# EAGLE design sensor card (EAGLE 9.6.2)
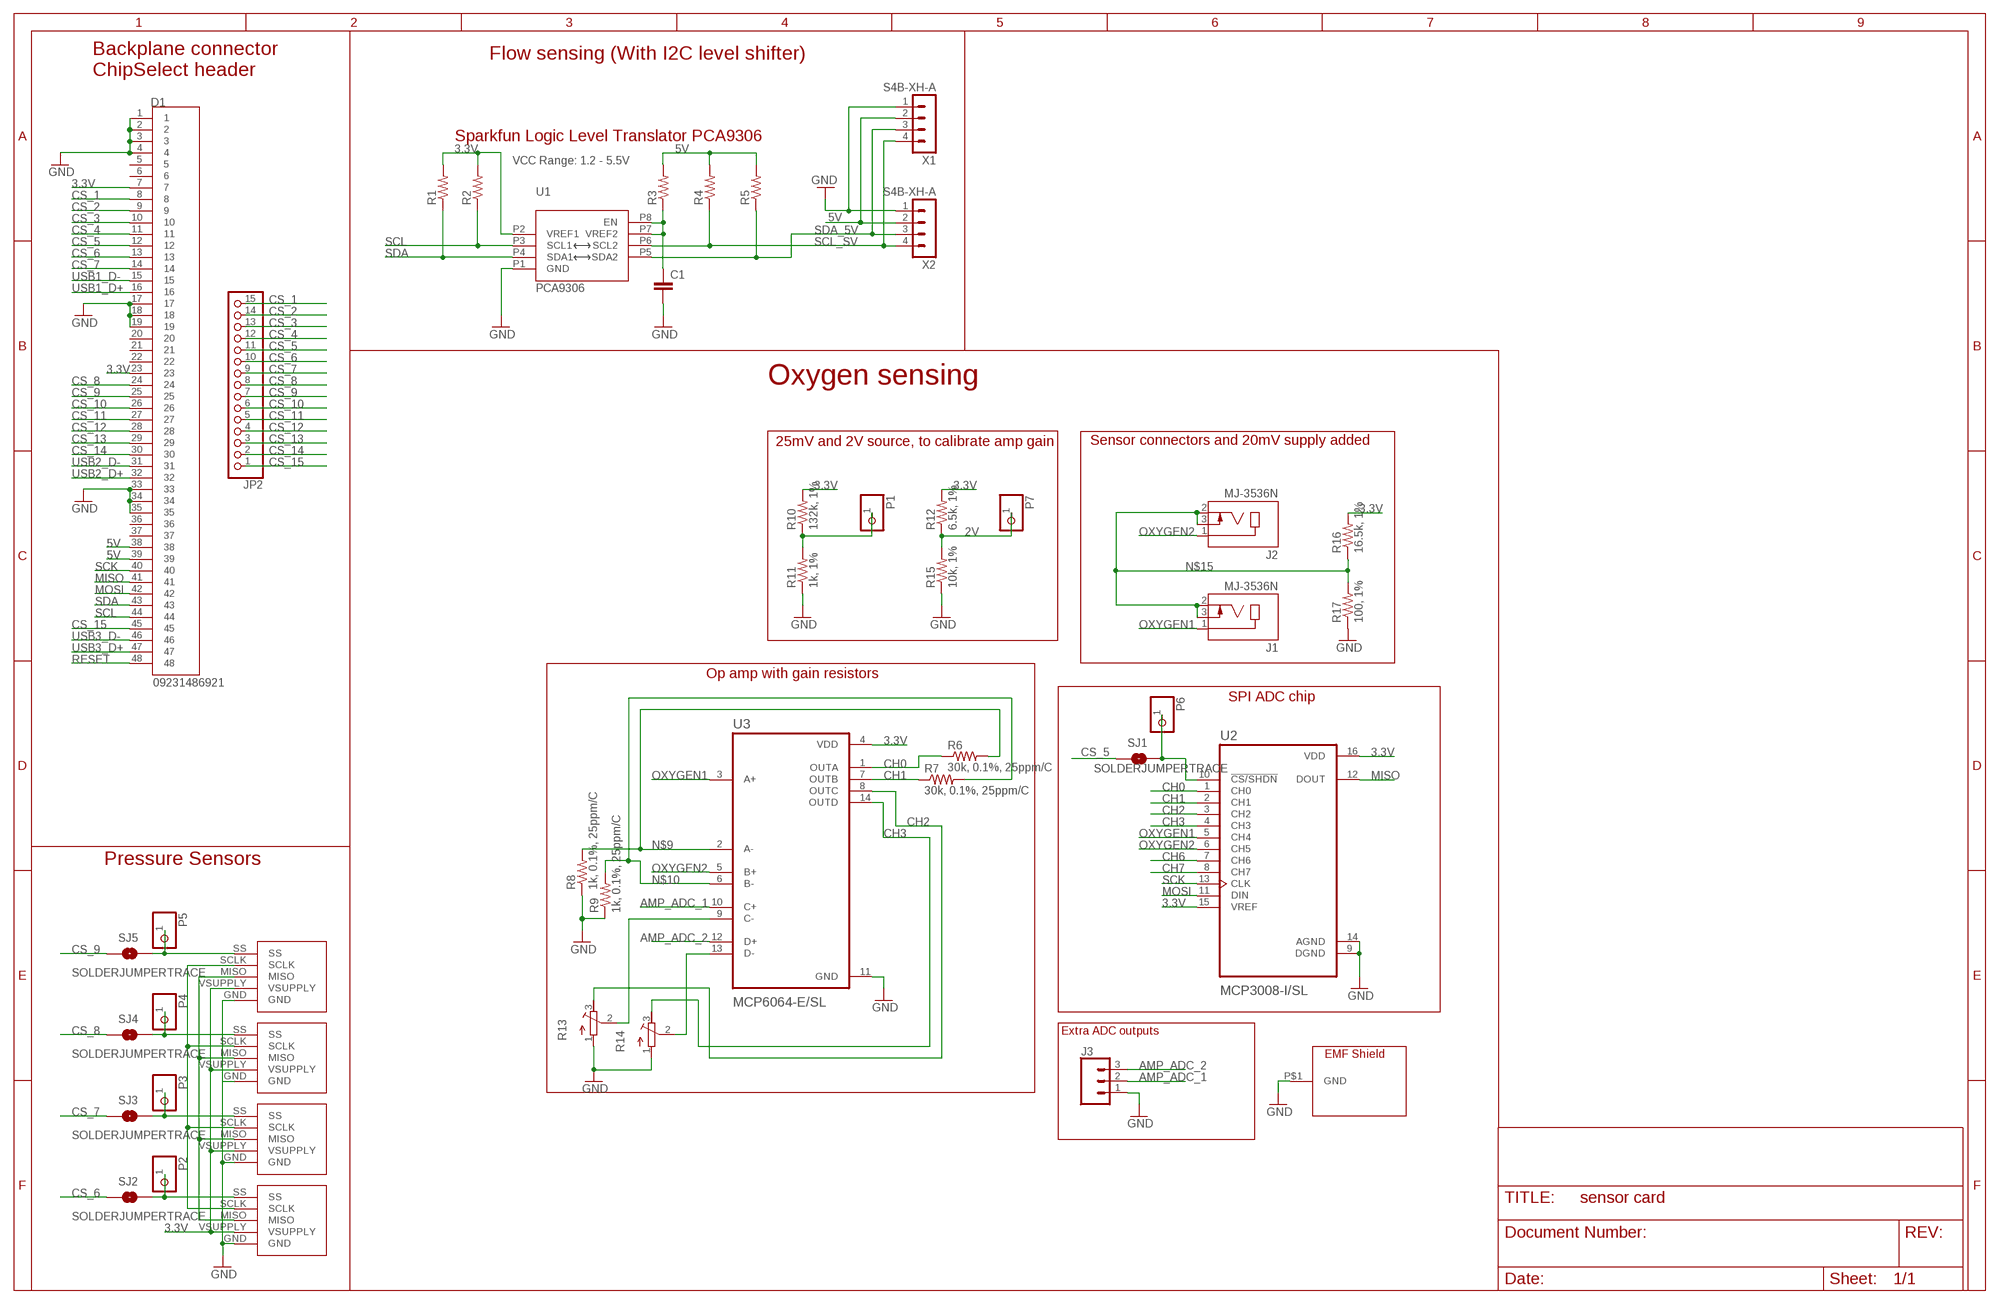
[diagram p0: schematic, sheet 1]

## Parts
C1  100pF  CAP0805  [0805]
D1  09231486921  [HARTING_09231486921]
J1  MJ-3536N  [CUI_MJ-3536N]
J2  MJ-3536N  [CUI_MJ-3536N]
J3  CONN_03  [1X03]
JP2  PINHD-1X15  [1X15]
P1  PINHD-1X1  [1X01]
P2  PINHD-1X1  [1X01]
P3  PINHD-1X1  [1X01]
P4  PINHD-1X1  [1X01]
P5  PINHD-1X1  [1X01]
P6  PINHD-1X1  [1X01]
P7  PINHD-1X1  [1X01]
R1  2.2k  RESISTOR0805-RES  [0805]
R2  2.2k  RESISTOR0805-RES  [0805]
R3  200K  RESISTOR0805-RES  [0805]
R4  2.2k  RESISTOR0805-RES  [0805]
R5  2.2k  RESISTOR0805-RES  [0805]
R6  30k, 0.1%, 25ppm/C  RESISTOR0805-RES  [0805]
R7  30k, 0.1%, 25ppm/C  RESISTOR0805-RES  [0805]
R8  1k, 0.1%, 25ppm/C  RESISTOR0805-RES  [0805]
R9  1k, 0.1%, 25ppm/C  RESISTOR0805-RES  [0805]
R10  132k, 1%  RESISTOR0805-RES  [0805]
R11  1k, 1%  RESISTOR0805-RES  [0805]
R12  6.5k, 1%  RESISTOR0805-RES  [0805]
R13  R-TRIMM3214W  [RTRIM3214W]
R14  R-TRIMM3214W  [RTRIM3214W]
R15  10k, 1%  RESISTOR0805-RES  [0805]
R16  16.5k, 1%  RESISTOR0805-RES  [0805]
R17  100, 1%  RESISTOR0805-RES  [0805]
SJ1  SOLDERJUMPERTRACE  [SJ_2S-TRACE]
SJ2  SOLDERJUMPERTRACE  [SJ_2S-TRACE]
SJ3  SOLDERJUMPERTRACE  [SJ_2S-TRACE]
SJ4  SOLDERJUMPERTRACE  [SJ_2S-TRACE]
SJ5  SOLDERJUMPERTRACE  [SJ_2S-TRACE]
U1  PCA9306  PCA9306VSSOP_8PIN  [VSSOP_8PIN]
U2  MCP3008-I/SL  [SOIC127P600X175-16N]
U3  MCP6064-E/SL  [SOIC127P600X175-14N]
U$1  SCCDRRV100MDSA3SSCDRRV100MDSA3  [DIP1270W53P254L1303H508Q8B]
U$2  EMI_SHIELD  [3671250]
U$3  SCCDRRV100MDSA3SSCDRRV100MDSA3  [DIP1270W53P254L1303H508Q8B]
U$4  SCCDRRV100MDSA3SSCDRRV100MDSA3  [DIP1270W53P254L1303H508Q8B]
U$5  SCCDRRV100MDSA3SSCDRRV100MDSA3  [DIP1270W53P254L1303H508Q8B]
X1  S4B-XH-A  [S4B-XH-A]
X2  S4B-XH-A  [S4B-XH-A]

## Nets
2V: P7.1 R12.1 R15.2
3.3V: D1.7 D1.23 R1.2 R2.2 R10.2 R12.2 R16.2 U1.P2(VREF1) U2.15(VREF) U2.16(VDD) U3.4(VDD) U$1.VSUPPLY U$3.VSUPPLY U$4.VSUPPLY U$5.VSUPPLY
5V: D1.38 D1.39 R3.2 R4.2 R5.2 X1.2 X2.2
50MILIVOLT: P1.1 R10.1 R11.2
AMP_ADC_1: J3.2 U3.10(C+)
AMP_ADC_2: J3.3 U3.12(D+)
CH0: R6.1 U2.1(CH0) U3.1(OUTA)
CH1: R7.1 U2.2(CH1) U3.7(OUTB)
CH2: R13.3(E) U2.3(CH2) U3.8(OUTC)
CH3: R14.3(E) U2.4(CH3) U3.14(OUTD)
CH6: U2.7(CH6)
CH7: U2.8(CH7)
CS_1: D1.8 JP2.15
CS_2: D1.9 JP2.14
CS_3: D1.10 JP2.13
CS_4: D1.11 JP2.12
CS_5: D1.12 JP2.11 SJ1.1
CS_6: D1.13 JP2.10 SJ2.1
CS_7: D1.14 JP2.9 SJ3.1
CS_8: D1.24 JP2.8 SJ4.1
CS_9: D1.25 JP2.7 SJ5.1
CS_10: D1.26 JP2.6
CS_11: D1.27 JP2.5
CS_12: D1.28 JP2.4
CS_13: D1.29 JP2.3
CS_14: D1.30 JP2.2
CS_15: D1.45 JP2.1
GND: C1.2 D1.1 D1.2 D1.3 D1.4 D1.17 D1.18 D1.19 D1.33 D1.34 D1.35 J3.1 R8.1 R9.1 R11.1 R13.1(A) R14.1(A) R15.1 R17.1 U1.P1(GND) U2.9(DGND) U2.14(AGND) U3.11(GND) U$1.GND U$2.P$1(GND) U$3.GND U$4.GND U$5.GND X1.1 X2.1
MISO: D1.41 U2.12(DOUT) U$1.MISO U$3.MISO U$4.MISO U$5.MISO
MOSI: D1.42 U2.11(DIN)
N$2: R14.2(S) U3.13(D-)
N$3: P6.1 SJ1.2 U2.10(!CS/SHDN)
N$6: P2.1 SJ2.2 U$5.SS
N$8: R13.2(S) U3.9(C-)
N$9: R6.2 R8.2 U3.2(A-)
N$10: R7.2 R9.2 U3.6(B-)
N$11: P4.1 SJ4.2 U$3.SS
N$12: P5.1 SJ5.2 U$1.SS
N$15: J1.2 J1.3 J2.2 J2.3 R16.1 R17.2
N$35: P3.1 SJ3.2 U$4.SS
OXYGEN1: J1.1 U2.5(CH4) U3.3(A+)
OXYGEN2: J2.1 U2.6(CH5) U3.5(B+)
RESET: D1.48
SCK: D1.40 U2.13(CLK) U$1.SCLK U$3.SCLK U$4.SCLK U$5.SCLK
SCL: D1.44 R2.1 U1.P3(SCL1)
SCL_SV: R4.1 U1.P6(SCL2) X1.4 X2.4
SDA: D1.43 R1.1 U1.P4(SDA1)
SDA_5V: R5.1 U1.P5(SDA2) X1.3 X2.3
USB1_D+: D1.16
USB1_D-: D1.15
USB2_D+: D1.32
USB2_D-: D1.31
USB3_D+: D1.47
USB3_D-: D1.46
VREF2_IN: C1.1 R3.1 U1.P7(VREF2) U1.P8(EN)
Unconnected: D1.5 D1.6 D1.20 D1.21 D1.22 D1.36 D1.37

## Notes on the sheet
- Flow sensing (With I2C level shifter)
- Backplane connector 
  ChipSelect header
- Sparkfun Logic Level Translator PCA9306
- VCC Range: 1.2 - 5.5V
- Oxygen sensing
- 25mV and 2V source, to calibrate amp gain | Sensor connectors and 20mV supply added
- Op amp with gain resistors
- SPI ADC chip
- Pressure Sensors
- Extra ADC outputs

## Library data of the parts
C1 = SparkFun-Passives:CAP: Capacitor Standard 0603 ceramic capacitor, and 0.1" leaded capacitor.; MANUFACTURER-PART-NUMBER: Generic; PACKAGE: 0805; SIMILAR-COMPONENTS: Other generic 0805 capacitors
D1 = din41612_48_pin_board:09231486921: Check prices <https://pricing.snapeda.com/parts/8-1393644-0/TE%20Connectivity/view-part?ref=eda>; MANUFACTURER-PART-NUMBER: 09231486921; PACKAGE: None
J1 J2 = MJ-3536N:MJ-3536N: 2 Conductors 3 Contacts 12V 3.5 mm Right Angle Through Hole Audio Jack Connector; MANUFACTURER-PART-NUMBER: MJ-3536N; PACKAGE: None
J3 = SparkFun-Connectors:CONN_03: Multi connection point. Often used as Generic Header-pin footprint for 0.1 inch spaced/style header connections On any of the 0.1 inch spaced packages, you can populate with these: Break Away Headers - Straight <https://www.sparkfun.com/products/116> (PRT-00116) Break Away Male Headers - Right Angle <https://www.sparkfun.com/products/553> (PRT-00553) Female Headers <https://www.sparkfun.com/products/115> (PRT-00115) Break Away Headers - Machine Pin <https://www.sparkfun.com/products/117> (PRT-00117) Break Away Female Headers - Swiss Machine Pin <https://www.sparkfun.com/products/743> (PRT-00743) Stackable Header - 3 Pin (Female, 0.1") <https://www.sparkfun.com/products/13875> (PRT-13875) For SCREWTERMINALS and SPRING TERMINALS visit here: Screw Terimnals on SparkFun.com <https://www.sparkfun.com/search/results?term=Screw+Terminals> (5mm/3.5mm/2.54mm spacing) This device is also useful as a general connection point to wire up your design to another part of your project. Our various solder wires solder well into these plated through hole pads. Hook-Up Wire - Assortment (Stranded, 22 AWG) <https://www.sparkfun.com/products/11375> (PRT-11375) Hook-Up Wire - Assortment (Solid Core, 22 AWG) <https://www.sparkfun.com/products/11367> (PRT-11367) View the entire wire category on our website here <https://www.sparkfun.com/categories/141> Special notes: Molex polarized connector foot print use with SKU : PRT-08232 with associated crimp pins and housings.
JP2 = pinhead:PINHD-1X15: PIN HEADER
P1-P7 = pinhead:PINHD-1X1: PIN HEADER
R1-R12 R15-R17 = SparkFun-Passives:RESISTOR: Resistor Basic schematic elements and footprints for 0603, 1206, and PTH resistors.; MANUFACTURER-PART-NUMBER: Generic; PACKAGE: 0805; SIMILAR-COMPONENTS: Generic 0805 resistors
R13 R14 = rcl:R-TRIMM: Trimm resistor; PURCHASE: https://www.digikey.ca/en/products/detail/bourns-inc/3214W-1-502G/2535183; SPICEMODEL: X; SPICEPREFIXL: POT
SJ1-SJ5 = SparkFun-Passives:SOLDERJUMPER: Solder Jumper Standard SMD solder jumper. Used to automate production. Two varients : Normally Open and Normally Closed are the same, but have different paste layers. NC will have a large amount of paste and should jumper during reflow.
U1 = SparkFun-IC-Comms:PCA9306: Bidirectional I2C level shifter Not compatible with all available part number pinout schemes- DOUBLE CHECK!!! Variants PCA9306DC and PSOP-8 are EOL. If your part has VREF as pin 1 then this is your variant. VSSOP_8PIN is not EOL. Datasheet <https://cdn.sparkfun.com/datasheets/BreakoutBoards/PCA9306DC.pdf> SparkFun Products SparkFun Inventor's Kit for RedBot <https://www.sparkfun.com/products/12649> (ROB-12649) SparkFun RedBot Basic Kit <https://www.sparkfun.com/products/13166> (ROB-13166) SparkFun Level Translator Breakout - PCA9306 <https://www.sparkfun.com/products/11955> (BOB-11955) SparkFun Block for Intel Edison - ADC <https://www.sparkfun.com/products/13770> (DEV-13770) SparkFun Block for Intel® Edison - Raspberry Pi B <https://www.sparkfun.com/products/13044> (DEV-13044) SparkFun RedBot Sensor - Accelerometer <https://www.sparkfun.com/products/12589> (SEN-12589); MANUFACTURER-PART-NUMBER: PCA9306D,118; PROD_ID: IC-14450
U2 = MCP3008-I_SL:MCP3008-I/SL: Check prices <https://pricing.snapeda.com/parts/MCP3008-I/SL/Microchip%20Technology/view-part?ref=eda>; MANUFACTURER-PART-NUMBER: MCP3008-I/SL; PACKAGE: SOIC-16
U3 = MCP6064-E_SL:MCP6064-E/SL: None Check prices <https://pricing.snapeda.com/parts/MCP6064-E/SL/Microchip/view-part?ref=eda>; MANUFACTURER-PART-NUMBER: MCP6064-E/SL; PACKAGE: SOIC-14 Microchip
U$1 U$3-U$5 = SCCDRRV100MDSA3:SCCDRRV100MDSA3
U$2 = emi cap:EMI_SHIELD; MANUFACTURER-PART-NUMBER: 3671250; PACKAGE: none
X1 X2 = con-JST XH:S4B-XH: JST XH series header 2.50mm pitch disconnectable crimp style connectors, horizontal (side entry type), 4 pins

## Net classes
1 POWER: clearance 0.508 mm

## Board
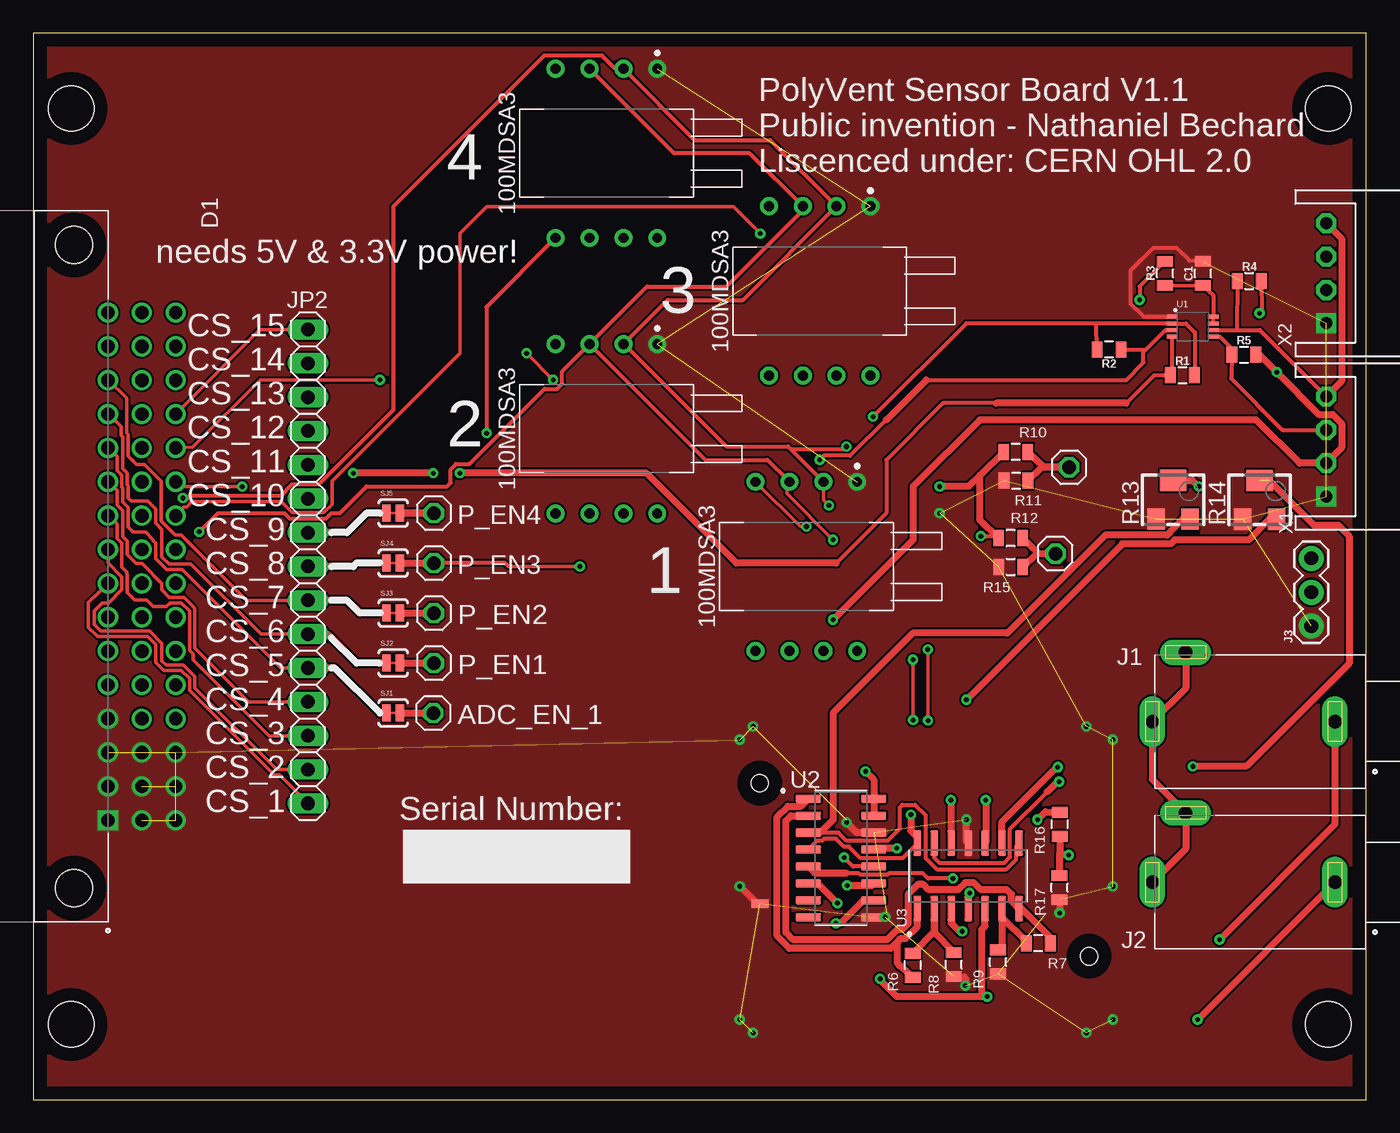
[diagram p1: board, top side]
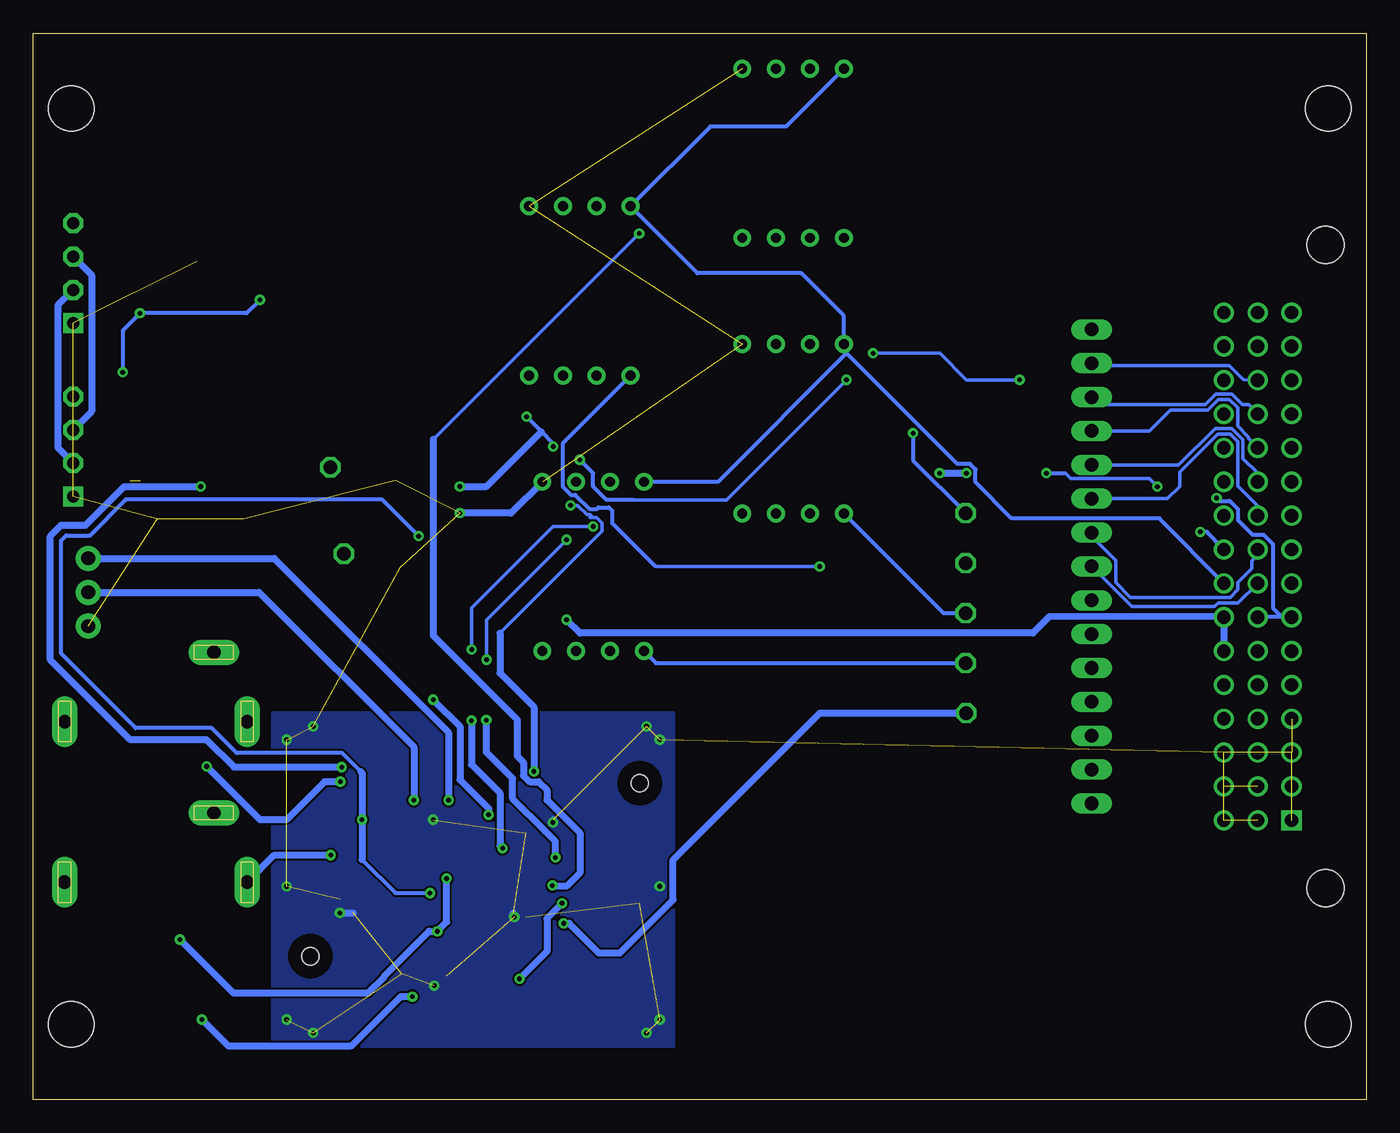
[diagram p2: board, bottom side, seen from below]

Size 100 x 80 mm. Coordinates in mm from the lower left corner, seen from the top.
Outline: 0,0 100,0 100,80 0,80 0,0
Copper layers (1*16): Top 0.035mm / dielectric 1.5mm / Bottom 0.035mm
Design rules "default": minimum track width 6mil, minimum drill 0.35mm, track to track 6mil, track to pad 6mil, pad to pad 6mil, via to via 6mil, smd to smd 6mil, copper to edge 40mil, drill to drill 6mil, minimum pad ring 10mil, minimum via ring 8mil, stop-mask expansion 4mil, vias tented up to drill 0mil, thermal gap 10mil
Holes 3.4 mm at 2.84,5.64 2.84,74.36 97.16,74.36 97.16,5.64

### Footprints (pad centres in the part's own frame; a part is rotated, then mirrored left to right if it is on the bottom)
0805 = smd 0.8 x 1.2: 1 -0.9,0; 2 0.9,0
HARTING_09231486921 = drill 1 pad 1.35 square: 1 0,0 | drill 1 pad 1.35: 2 -2.54,0; 3 -5.08,0; 4 -7.62,0; 5 -10.16,0; 6 -12.7,0; 7 -15.24,0; 8 -17.78,0; 9 -20.32,0; 10 -22.86,0; 11 -25.4,0; 12 -27.94,0; 13 -30.48,0; 14 -33.02,0; 15 -35.56,0; 16 -38.1,0; 17 0,2.54; 18 -2.54,2.54; 19 -5.08,2.54; 20 -7.62,2.54; 21 -10.16,2.54; 22 -12.7,2.54; 23 -15.24,2.54; 24 -17.78,2.54; 25 -20.32,2.54; 26 -22.86,2.54; 27 -25.4,2.54; 28 -27.94,2.54; 29 -30.48,2.54; 30 -33.02,2.54; 31 -35.56,2.54; 32 -38.1,2.54; 33 0,5.08; 34 -2.54,5.08; 35 -5.08,5.08; 36 -7.62,5.08; 37 -10.16,5.08; 38 -12.7,5.08; 39 -15.24,5.08; 40 -17.78,5.08; 41 -20.32,5.08; 42 -22.86,5.08; 43 -25.4,5.08; 44 -27.94,5.08; 45 -30.48,5.08; 46 -33.02,5.08; 47 -35.56,5.08; 48 -38.1,5.08 | hole 2.8: -43.18,-2.54; 5.08,-2.54
CUI_MJ-3536N = drill 1 pad 1.9 long: 1 -5.6,0; 2 8.1,0; 3 5.6,-5.2
1X03 = drill 1.016 pad 1.88: 1 0,0; 2 2.54,0; 3 5.08,0
1X15 = drill 1.016 long: 1 -17.78,0; 2 -15.24,0; 3 -12.7,0; 4 -10.16,0; 5 -7.62,0; 6 -5.08,0; 7 -2.54,0; 8 0,0; 9 2.54,0; 10 5.08,0; 11 7.62,0; 12 10.16,0; 13 12.7,0; 14 15.24,0; 15 17.78,0
1X01 = drill 1.016 octagon: 1 0,0
RTRIM3214W = smd 1.3 x 1.6: 1 -1.275,-1.45; 3 1.275,-1.45 | smd 2 x 1.6: 2 0,1.45
SJ_2S-TRACE = smd 0.635 x 1.27: 1 -0.508,0; 2 0.508,0
VSSOP_8PIN = smd 0.8 x 0.3: P1 -1.57,0.734; P2 -1.57,0.234; P3 -1.57,-0.266; P4 -1.57,-0.766; P5 1.53,-0.766; P6 1.53,-0.266; P7 1.53,0.234; P8 1.53,0.734
SOIC127P600X175-16N = smd 1.9 x 0.6: 1 -2.455,4.445; 2 -2.455,3.175; 3 -2.455,1.905; 4 -2.455,0.635; 5 -2.455,-0.635; 6 -2.455,-1.905; 7 -2.455,-3.175; 8 -2.455,-4.445; 9 2.455,-4.445; 10 2.455,-3.175; 11 2.455,-1.905; 12 2.455,-0.635; 13 2.455,0.635; 14 2.455,1.905; 15 2.455,3.175; 16 2.455,4.445
SOIC127P600X175-14N = smd 1.9 x 0.6: 1 -2.455,3.81; 2 -2.455,2.54; 3 -2.455,1.27; 4 -2.455,0; 5 -2.455,-1.27; 6 -2.455,-2.54; 7 -2.455,-3.81; 8 2.455,-3.81; 9 2.455,-2.54; 10 2.455,-1.27; 11 2.455,0; 12 2.455,1.27; 13 2.455,2.54; 14 2.455,3.81
DIP1270W53P254L1303H508Q8B = drill 0.743 pad 1.343: 6 6.35,-1.27; 7 6.35,1.27; 8 6.35,3.81; GND -6.35,3.81; MISO -6.35,-1.27; SCLK -6.35,-3.81; SS 6.35,-3.81; VSUPPLY -6.35,1.27
3671250 = smd 1.27 x 0.635: P$1 0,8.61 | hole 1.3: 0,17.65; 24.7,4.65
S4B-XH-A = drill 0.9 pad 1.5 square: 1 3.75,0 | drill 0.9 pad 1.5 octagon: 2 1.25,0; 3 -1.25,0; 4 -3.75,0

### Placement (x,y rotation side)
C1  87.75,61.98 90 top
D1  5.6,20.95 270 top
J1  92.05,28.36 180 top
J2  92.06,16.31 180 top
J3  95.88,35.52 90 top
JP2  20.6,40 270 top
P1  77.72,47.44 180 top
P2  30.05,32.75 0 top
P3  30.05,36.5 0 top
P4  30.05,40.25 0 top
P5  30.05,44 0 top
P6  30,29 0 top
P7  76.69,40.96 180 top
R1  86.21,54.34 0 top
R2  80.7,56.27 180 top
R3  84.91,61.99 90 top
R4  91.23,61.42 0 top
R5  90.82,55.88 0 top
R6  65.99,10.07 90 top
R7  75.4,11.72 180 top
R8  69.05,10.13 90 top
R9  72.37,10.33 90 top
R10  73.71,48.59 180 top
R11  73.72,46.44 0 top
R12  73.32,42.12 180 top
R13  85.51,45.01 0 top
R14  92,45 0 top
R15  73.33,39.96 0 top
R16  77.01,20.65 90 top
R17  76.99,15.91 90 top
SJ1  27,29 0 top
SJ2  27,32.75 0 top
SJ3  27,36.5 0 top
SJ4  27,40.25 0 top
SJ5  27,44 0 top
U1  87,58 0 top
U2  60.6,18.12 0 top
U3  70.14,16.78 90 top
U$1  43,71 270 top
U$2  54.51,6.1 0 top
U$3  59,60.67 270 top
U$4  43,50.33 270 top
U$5  58,40 270 top
X1  97,49 270 top
X2  97,62 270 top

### Tracks (layer width: path | path; a pad name or v marks a point on that pad's centre or on a via)
2V
  Top 0.508: R15.2 75.28,40.96 | R12.1 75.28,41.11 75.28,40.96 | 75.28,40.96 P7.1
3.3V  (via drill 0.35)
  Top 0.254: v59.69,44.58 59.27,45 U$5.VSUPPLY
  Top 0.305: 56.81,48.81 56.62,49 52,49 44.32,56.68 U$4.VSUPPLY 47.59,60 53.25,60 U$3.VSUPPLY 55.29,72 49.62,72 U$1.VSUPPLY 43.65,77.35 42.67,78.33 38.33,78.33 27,67 27,51.75 21.4,46.15 19.4,46.15 18.55,45.3 11.71,45.3 11.42,45 11.36,45 v11.23,45.13 | 56.81,48.81 U$5.VSUPPLY | 79.75,58.23 70,58.23 v63,51.23 | R1.2 87.15,54.35 87.15,57.56 86.48,58.23 U1.P2 79.75,58.23 | R2.2 79.75,58.23 | 56.81,48.81 60.81,48.81 v61,49 | v70.24,15.49 70.24,14.43 U3.4 | v71.09,42.27 72.22,42.27 R12.2
  Top 0.508: v62.44,24.62 63.05,24 U2.16 U2.15 | R10.2 71,46.83 | R12.2 71,43.49 71,46.83 | 71,46.83 70.17,46 v68,46 | v75.34,21 75.94,21.6 R16.2
  Bottom 0.254: 58,43.66 57.73,43.66 57.34,43.27 57.34,42.66 65,35 | 58,43.66 58.23,43.66 | 58,43.66 58.23,43.88 58.46,43.88 59.16,44.58 v59.69,44.58
  Bottom 0.305: v11.23,45.13 11.02,44.92 10.24,44.92 9.62,44.3 9.62,43.47 8.53,42.38 7.7,42.38 7,41.68 7,36.88 6.36,36.24 D1.7 D1.23 | v61,49 61,49.23 61.88,50.12 v63,51.23 | 75.34,18 72.83,15.49 v70.24,15.49 | 75.42,24.6 76.82,26 84.73,26 86.61,27.88 92.33,27.88 97.92,33.47 97.92,41.93 97.52,42.33 95.75,42.33 93.04,45.04 73.86,45.04 v71.09,42.27
  Bottom 0.508: 65,35 65,32 62.44,29.44 v62.44,24.62 | v68,46 66,46 61.88,50.12 | 75.42,24.6 75.34,24.52 v75.34,21 75.34,18
5V  (via drill 0.35)
  Top 0.305: R3.2 83,61.03 v83,60 | 98,48.75 X1.2 | v93.29,54.57 v93.29,54.56 | R4.2 92.18,59.18 v92,59
  Top 0.508: R5.2 91.98,55.88 v93.29,54.57 96.45,51.41 97.48,51.41 98.16,50.73 98.16,48.91 X1.2 95,47.75 91.75,51 71,51 66,46 66,42 v60,36
  Bottom 0.305: v83,60 84,59 v92,59 93.29,57.71 v93.29,54.57
  Bottom 0.508: v60,36 59,35 25,35 23.76,36.24 D1.39 D1.38 | X2.2 98.16,59.59 98.16,48.91 X1.2
50MILIVOLT
  Top 0.508: R11.2 75.67,47.44 P1.1 75.81,47.44 R10.1
AMP_ADC_1  (via drill 0.35)
  Top 0.508: v71.45,22.46 71.45,19.27 U3.10
  Bottom 0.508: J3.2 83.06,38.06 71.45,26.45 v71.45,22.46
AMP_ADC_2  (via drill 0.35)
  Top 0.508: v68.85,22.46 68.85,19.25 U3.12
  Bottom 0.508: J3.3 81.92,40.6 68.85,27.53 v68.85,22.46
CH0
  Top 0.508: 64.83,11.84 64.83,10.2 65.07,9.96 65.15,9.96 R6.1 | 64.83,11.84 65.07,12.08 65.44,12.08 66.33,12.97 U3.1 | 64.83,11.84 64.33,11.34 56.73,11.34 55.8,12.27 55.8,21.19 56.61,22 57.58,22 U2.1
CH1
  Top 0.508: R7.1 76.35,12.13 74.16,14.32 U3.7 73.39,14.89 73.39,15.4 73.04,15.75 71.09,15.75 70.56,16.27 69.92,16.27 69.39,15.75 67.17,15.75 66.78,16.13 66.36,16.13 65.62,15.4 65.62,13.2 65.16,12.74 64.8,12.74 64.06,12 57,12 56.46,12.54 56.46,20.92 56.84,21.3 U2.2
CH2
  Top 0.305: U2.3 60.42,20.02 61.02,19.42 64.09,19.42 65,20.33 65,21.91 65.2,22.11 66.16,22.11 66.95,21.32 66.95,18.11 67.78,17.28 73.01,17.28 73.74,18.01 73.74,19.03 U3.8
  Top 0.508: U2.3 58.99,20.02 59.09,20.13 59.13,20.13 60,21 60,29 66,35 73.07,35 80.42,42.35 85.05,42.35 85.29,42.59 85.29,42.61 86.24,43.56 R13.3
CH3  (via drill 0.35)
  Top 0.305: U3.14 65.2,18.11 62.06,18.11 61.21,18.96 60.83,18.96 60.23,19.57 59.33,19.57 59.18,19.42 58.81,19.42 U2.4
  Top 0.508: R14.3 92.75,43.55 91.2,42 85.63,42 85.33,41.69 81.69,41.69 v70,30 | v65.84,21.37 65.84,20.16 66.33,19.67 U3.14
  Bottom 0.508: v65.84,21.37 65.84,21.84 68,24 68,28 v70,30
CS_1
  Top 0.254: D1.8 4.13,37.31 4.13,35.43 4.83,34.73 8.57,34.73 9.17,34.13 9.17,32.81 9.79,32.19 11.11,32.19 11.71,31.59 11.71,30.71 18.07,24.35 18.47,24.35 JP2.15
CS_2
  Top 0.254: JP2.14 18.24,24.76 12.12,30.88 12.12,31.76 11.26,32.62 9.95,32.62 9.65,32.92 9.65,34.23 8.74,35.14 5.06,35.14 4.57,35.63 4.57,36.67 5.17,37.27 5.64,37.27 6.63,38.26 6.63,39.21 5.6,40.24 D1.9
CS_3
  Top 0.254: JP2.13 17.7,27.3 12,33 12,33.42 11.71,33.71 11.71,36.67 11.11,37.27 10.25,37.27 9.98,37 9,37 8.5,37.5 7.59,37.5 7.04,38.05 7.04,39.38 7,39.42 7,39.59 6.63,39.96 6.63,41.75 6.29,42.09 6.29,43.17 D1.10
CS_4
  Top 0.254: JP2.12 16.16,29.84 12.12,33.88 12.12,36.84 12,36.96 12,37 11.31,37.69 10.21,37.69 9.65,38.25 9.65,38.73 8.16,40.22 7.7,40.22 7.04,40.88 7.04,41.92 6.7,42.26 6.7,44.19 6.29,44.59 6.29,45.71 D1.11
CS_5
  Top 0.254: JP2.11 18.54,32.38 11.16,39.76 9.99,39.76 9.17,40.58 9.17,41.75 9,41.92 9,42 8.41,42.59 7.49,42.59 7.11,42.97 7.11,44.41 6.7,44.82 6.7,45.88 6.63,45.94 6.63,46.83 6.59,46.87 6.59,46.88 6.29,47.17 6.29,48.25 D1.12
  Top 0.508: JP2.11 22.62,32.38 26,29 SJ1.1
CS_6
  Top 0.254: JP2.10 17.08,34.92 11.82,40.18 10.19,40.18 9.65,40.72 9.65,42.78 9.17,43.25 9.17,44.29 8.57,44.89 7.34,44.89 7.11,45.13 7.11,46.04 7.04,46.11 7.04,47 7,47.04 6.7,47.34 6.7,49.73 6.59,49.83 6.59,50.49 D1.13
  Top 0.508: SJ2.1 24.25,32.75 22.08,34.92 JP2.10
CS_7
  Top 0.254: JP2.9 16,37.46 11.11,42.35 10.65,42.35 9.58,43.42 9.58,46.42 8.37,47.64 7.75,47.64 7.11,48.28 7.11,49.89 7,50 7,52.62 D1.14
  Top 0.508: SJ3.1 24.5,36.5 23.54,37.46 JP2.9
CS_8
  Top 0.508: SJ4.1 24.25,40.25 24,40 JP2.8
  Bottom 0.254: JP2.8 17.6,37 11.38,37 11.11,37.27 9.65,37.27 D1.24
CS_9
  Top 0.508: SJ5.1 25,44 23.54,42.54 JP2.7
  Bottom 0.254: D1.25 8.14,40.86 8.59,40.41 8.59,39.83 9.65,38.78 9.65,38.25 10.21,37.69 17.69,37.69 18.8,38.8 18.8,40.43 20.6,42.23 JP2.7
CS_10
  Bottom 0.254: D1.26 8.14,44.52 9.65,46.02 9.65,49.37 10.2,49.92 10.92,49.92 10.94,49.94 11.14,49.94 14,47.08 14,46 14.92,45.08 JP2.6
CS_11
  Bottom 0.254: D1.27 8.14,47 9.24,48.1 9.24,49.54 10.06,50.36 11.32,50.36 14.09,47.59 20.57,47.59 JP2.5
CS_12
  Bottom 0.254: D1.28 8.83,49.63 8.83,49.7 9.65,50.52 9.65,51.91 10.25,52.51 11.11,52.51 11.9,51.72 14.7,51.72 16.26,50.16 JP2.4
CS_13
  Bottom 0.254: D1.29 8.79,52.13 9.29,52.13 10.08,52.92 11.28,52.92 12.07,52.13 20.03,52.13 JP2.3
CS_14
  Bottom 0.254: D1.30 9.22,54.02 10.25,55.05 20.41,55.05 JP2.2
CS_15
  Top 0.254: D1.45 16.98,57.78 JP2.1
GND  (via drill 0.35)  (37 unrouted)
  Top 0.305: 87.52,63.06 C1.2 86.75,62.93 85.79,63.9 84.03,63.9 82.32,62.18 82.32,59.72 82.72,59.32 82.75,59.32 83.34,58.73 U1.P1
  Top 0.508: U2.9 63.88,13.68 v63.91,13.7 | U2.14 61.78,20.02 v61.02,20.79 | U3.11 70,19.38 v70,21 | R8.1 69.87,9.18 69.92,9.13 v69.92,8.54 | R17.1 77,14.95 v77,14 | U$2.P$1 54.4,14.6 v53,16
  Bottom 0.508: v63.91,13.7 64,13.79 64,14 | v61.02,20.79 61,20.81 61,21 | v77,14 76,14 | U$5.GND 64.16,44 v68,44
  other vias: 54,28 53,27 53,6 54,5 81,6 79,5 81,16 81,27 79,28
  pour Top (no thermals): 0,80 0,0 100,0 100,80
  pour Bottom: 52,29 52,4 82,4 82,29
MISO  (via drill 0.35)
  Top 0.254: v60,42 56.54,45.46 56.54,46.54 | v66,33 v66.01,32.99 v66.01,28.47
  Top 0.305: v12.44,42.59 13.85,44 18.84,44 19.23,43.61 21.97,43.61 22.36,44 23,44 25,46 31.05,46 31.32,46.27 31.32,47.28 31.72,47.68 32.73,47.68 38.36,53.32 39.28,53.32 39.68,53.72 39.68,54.64 U$4.MISO | U$4.MISO 46.05,61 52,61 57.73,66.73 U$3.MISO 53.75,71 48.08,71 U$1.MISO | U$4.MISO 50.41,48 55.08,48 56.54,46.54 U$5.MISO | U2.12 61.51,17.48 v60.83,18.16
  Bottom 0.254: v60,42 66,36 v66,33
  Bottom 0.305: D1.41 11.95,42.59 v12.44,42.59
  Bottom 0.508: v60.83,18.16 60.83,19.36 61.57,20.1 64.04,22.57 64.04,24.08 66.01,26.05 v66.01,28.47
MOSI  (via drill 0.35)
  Top 0.254: D1.42 11.29,44.47 11.5,44.47 11.89,44.87 18.58,44.87 19.41,44.04 21.79,44.04 22.4,44.65 22.4,46.4 32,56 32,65 34,67 52.52,67 v54.54,64.98
  Top 0.508: v61.05,16.05 62.9,16.05 U2.11
  Bottom 0.254: v54.54,64.98 70,49.52
  Bottom 0.508: 70,49.52 70,34.81 63.7,28.51 63.7,25.78 63.23,25.31 63.23,24.3 62.77,23.84 62.08,23.84 61.47,23.22 61.47,22.47 59,20 59,17 60,16 61,16 v61.05,16.05
N$2  (via drill 0.35)  (1 unrouted)
  Top 0.305: U3.13 67.6,18.15 67.99,17.76 72.84,17.76 73.28,18.2 73.28,20.3 76.08,23.09
  Top 0.508: 92.72,46.45 96.08,43.09 97.91,43.09 98.73,42.27 98.73,32.73 91,25 v87,25 | 76.08,23.09 76.84,23.85 v76.96,23.85
  Bottom 0.508: v76.96,23.85 78.15,23.85 81,21 83,21 v87,25
N$3  (via drill 0.35)
  Top 0.508: SJ1.2 P6.1 | U2.10 63.04,14.93 62.27,14.93 60.56,13.22 v60.21,13.22
  Bottom 0.508: v60.21,13.22 59.8,13.22 57.58,11 56,11 52,15 52,18 41,29 P6.1
N$6
  Top 0.508: SJ2.2 P2.1
  Bottom 0.305: U$5.SS 53.29,32.75 P2.1
N$8  (via drill 0.35)
  Top 0.508: U3.9 72.68,20.84 76.82,24.98 v76.86,24.94 | R13.2 86.97,46.46 v87.44,45.99
  Bottom 0.508: v87.44,45.99 93.19,45.99 96.08,43.09 97.91,43.09 98.73,42.27 98.73,33 92.73,27 87,27 84.94,24.94 v76.86,24.94
N$9
  Top 0.508: R8.2 67.6,12.53 U3.2 67.6,12.63 R6.2
N$10
  Top 0.508: R7.2 74.45,11.91 72.68,13.68 U3.6 72.68,11.59 R9.2
N$11  (via drill 0.35)
  Top 0.254: 35.66,40 v41,40
  Top 0.305: 35.66,40 35.39,40.27 30.07,40.27 P4.1
  Top 0.508: SJ4.2 P4.1
  Bottom 0.254: v41,40 53.3,40
  Bottom 0.305: 53.3,40 56.57,43.27 56.57,44.18 56.82,44.43 57.6,44.43 57.72,44.32 58.28,44.32 59.34,45.37 59.67,45.37 60.15,45.85 60.25,45.95 60.25,49.26 U$3.SS
N$12  (via drill 0.35)
  Top 0.305: U$1.SS 34,59.46 v34,50
  Top 0.508: 27.89,44 P5.1 SJ5.2
  Bottom 0.305: v34,50 34,47.95 P5.1
N$15  (via drill 0.35)
  Top 0.508: R16.1 77.01,18.48 76.99,18.48 | 76.99,18.48 R17.2 | J1.3 86.45,30.86 J1.2 83.95,24.02 J2.3 86.46,18.81 J2.2 | v77.68,18.34 77.13,18.34 76.99,18.48
  Bottom 0.508: J2.2 81.93,18.34 v77.68,18.34
N$35
  Top 0.508: SJ3.2 P3.1
  Bottom 0.305: U$4.SS 31.71,36.5 P3.1
OXYGEN1  (via drill 0.35)
  Top 0.305: 61,17 61.9,17 62.02,16.88 64.09,16.88 64.21,17 66.71,17 67.12,16.59 v68.98,16.59 v68.99,16.58
  Top 0.508: J1.1 97.65,20.65 v89,12 | U3.3 68.87,13.23 69.48,12.62 v69.69,12.62 | 61,17 58.63,17 U2.5
  Bottom 0.508: v89,12 85,8 74.88,8 73.66,9.22 73.66,9.27 70.31,12.62 v69.69,12.62 68.99,13.32 v68.99,16.58
OXYGEN2  (via drill 0.35)
  Top 0.508: J2.1 v87.35,6 | U3.5 71.41,13.01 71.14,12.74 71.14,8.04 71.46,7.72 | v63.53,9.05 63.53,8.98 64.79,7.72 71.46,7.72 | v60.33,14.73 58.84,16.21 U2.6 | v71.56,7.72 71.46,7.72
  Bottom 0.508: v63.53,9.05 61.47,11.12 61.47,13.59 v60.33,14.73 | v71.56,7.72 72.44,7.72 76.16,4 85.35,4 v87.35,6
SCK  (via drill 0.35)
  Top 0.254: v58,43 57.54,43 U$5.SCLK | v67.11,33.77 67.11,28.45 v67.13,28.43
  Top 0.508: v64.79,18.85 63.15,18.85 U2.13
  Bottom 0.254: v58,43 61,43 67.11,36.89 v67.11,33.77
  Bottom 0.305: D1.40 15.51,43.61 26.61,43.61 29.32,46.32 29.32,47.28 29.72,47.68 30.68,47.68 39,56 | 39,56 39.19,56.19 U$4.SCLK 39.19,58.81 42.38,62 50.17,62 U$3.SCLK 49.21,73 43.54,73 U$1.SCLK | U$5.SCLK 48.65,46.35 39,56
  Bottom 0.508: v64.79,18.85 65,19.07 65,23 67.13,25.13 v67.13,28.43
SCL  (via drill 0.35)
  Top 0.254: D1.44 11.94,48.94 17,54 v26,54 | v37,56 v39,54
  Top 0.305: U1.P3 85,57.73 84.95,57.69 84.9,57.69 83.48,56.27 | 67,54 82,54 83.3,55.3 83.3,56.08 83.48,56.27 | R2.1 83.48,56.27 | v59,48 59.32,48.32 61.28,48.32 63.97,51 64,51
  Top 0.508: 67,54 64,51
  Bottom 0.254: v26,54 30,54 32,56 v37,56 | v39,54 48,45 55,45
  Bottom 0.305: 55,45 57,45 58,46 58,47 v59,48
SCL_SV
  Top 0.305: U1.P6 90.27,57.73 | 90.27,57.73 92.02,57.73 X1.4 | R4.1 90.28,57.74 90.27,57.73
  Top 0.508: X2.4 98.16,64.59 98.16,53.91 X1.4
SDA  (via drill 0.35)
  Top 0.254: v15.67,45.98 11.1,45.98 D1.43
  Top 0.305: U1.P4 85.43,54.36 R1.1 84.09,54.34 82,52.25 | 72.25,52.25 68.25,52.25 64,48 64,44 60.25,40.25
  Top 0.508: v32,47 46,47 52.75,40.25 60.25,40.25 | v30,47 v24,47 | 82,52.25 72.25,52.25
  Bottom 0.254: 22.59,47 22.16,46.58 16.27,46.58 v15.67,45.98
  Bottom 0.305: v24,47 22.59,47
  Bottom 0.508: v32,47 v30,47
SDA_5V
  Top 0.305: U1.P5 89,57.23 89.87,56.36 R5.1 89.87,54.1 93.72,50.25 X1.3
  Bottom 0.508: X1.3 95.62,51.62 95.62,61.88 X2.3
VREF2_IN
  Top 0.305: U1.P7 U1.P8 88.53,60.35 C1.1 84.92,61.03 R3.1

### Text on the board
tNames: PolyVent Sensor Board V1.1 / Public invention - Nathaniel Bechard / Liscenced under: CERN OHL 2.0 | 4 | needs 5V & 3.3V power! | 3 | 2 | P_EN4 | P_EN3 | 1 | P_EN2 | P_EN1 | ADC_EN_1 | Serial Number: | CS_15 / CS_14 / CS_13 / CS_12 / CS_11 / CS_10 / CS_9 / CS_8 / CS_7 / CS_6 / CS_5 / CS_4 / CS_3 / CS_2 / CS_1